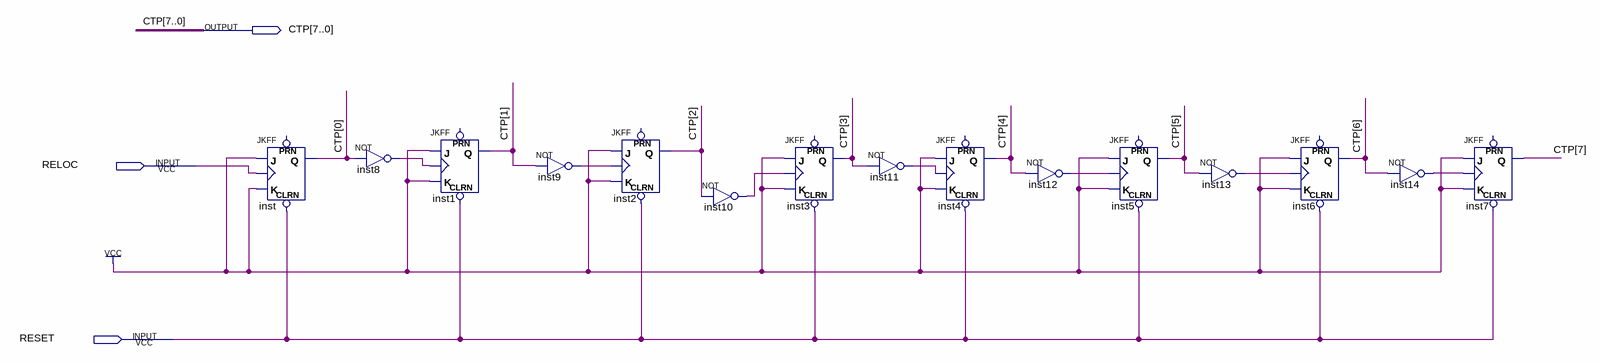
[diagram p0: schematic sheet]
// Quartus schematic cp.bdf as structural Verilog: 15 symbols, 3 pins
module cp (
  input  RELOC,
  input  RESET,
  output [7:0] CTP
);

  wire inst8_out, inst9_out, inst10_out, inst11_out, inst12_out, inst13_out, inst14_out;

  JKFF inst (.CLRN(RESET), .K(1'b1), .J(1'b1), .CLK(RELOC), .Q(CTP[0]));  // open: PRN
  not inst8 (inst8_out, CTP[0]);
  JKFF inst1 (.CLRN(RESET), .K(1'b1), .J(1'b1), .CLK(inst8_out), .Q(CTP[1]));  // open: PRN
  not inst9 (inst9_out, CTP[1]);
  JKFF inst2 (.CLRN(RESET), .K(1'b1), .J(1'b1), .CLK(inst9_out), .Q(CTP[2]));  // open: PRN
  not inst10 (inst10_out, CTP[2]);
  JKFF inst3 (.CLRN(RESET), .K(1'b1), .J(1'b1), .CLK(inst10_out), .Q(CTP[3]));  // open: PRN
  not inst11 (inst11_out, CTP[3]);
  JKFF inst4 (.CLRN(RESET), .K(1'b1), .J(1'b1), .CLK(inst11_out), .Q(CTP[4]));  // open: PRN
  not inst12 (inst12_out, CTP[4]);
  JKFF inst5 (.CLRN(RESET), .K(1'b1), .J(1'b1), .CLK(inst12_out), .Q(CTP[5]));  // open: PRN
  not inst13 (inst13_out, CTP[5]);
  JKFF inst6 (.CLRN(RESET), .K(1'b1), .J(1'b1), .CLK(inst13_out), .Q(CTP[6]));  // open: PRN
  not inst14 (inst14_out, CTP[6]);
  JKFF inst7 (.CLRN(RESET), .K(1'b1), .J(1'b1), .CLK(inst14_out), .Q(CTP[7]));  // open: PRN
endmodule
